# Altium schematic sheet Smartwatch_Microcontroller.SchDoc
size A4; SheetNumber: 3; SheetTotal: 4
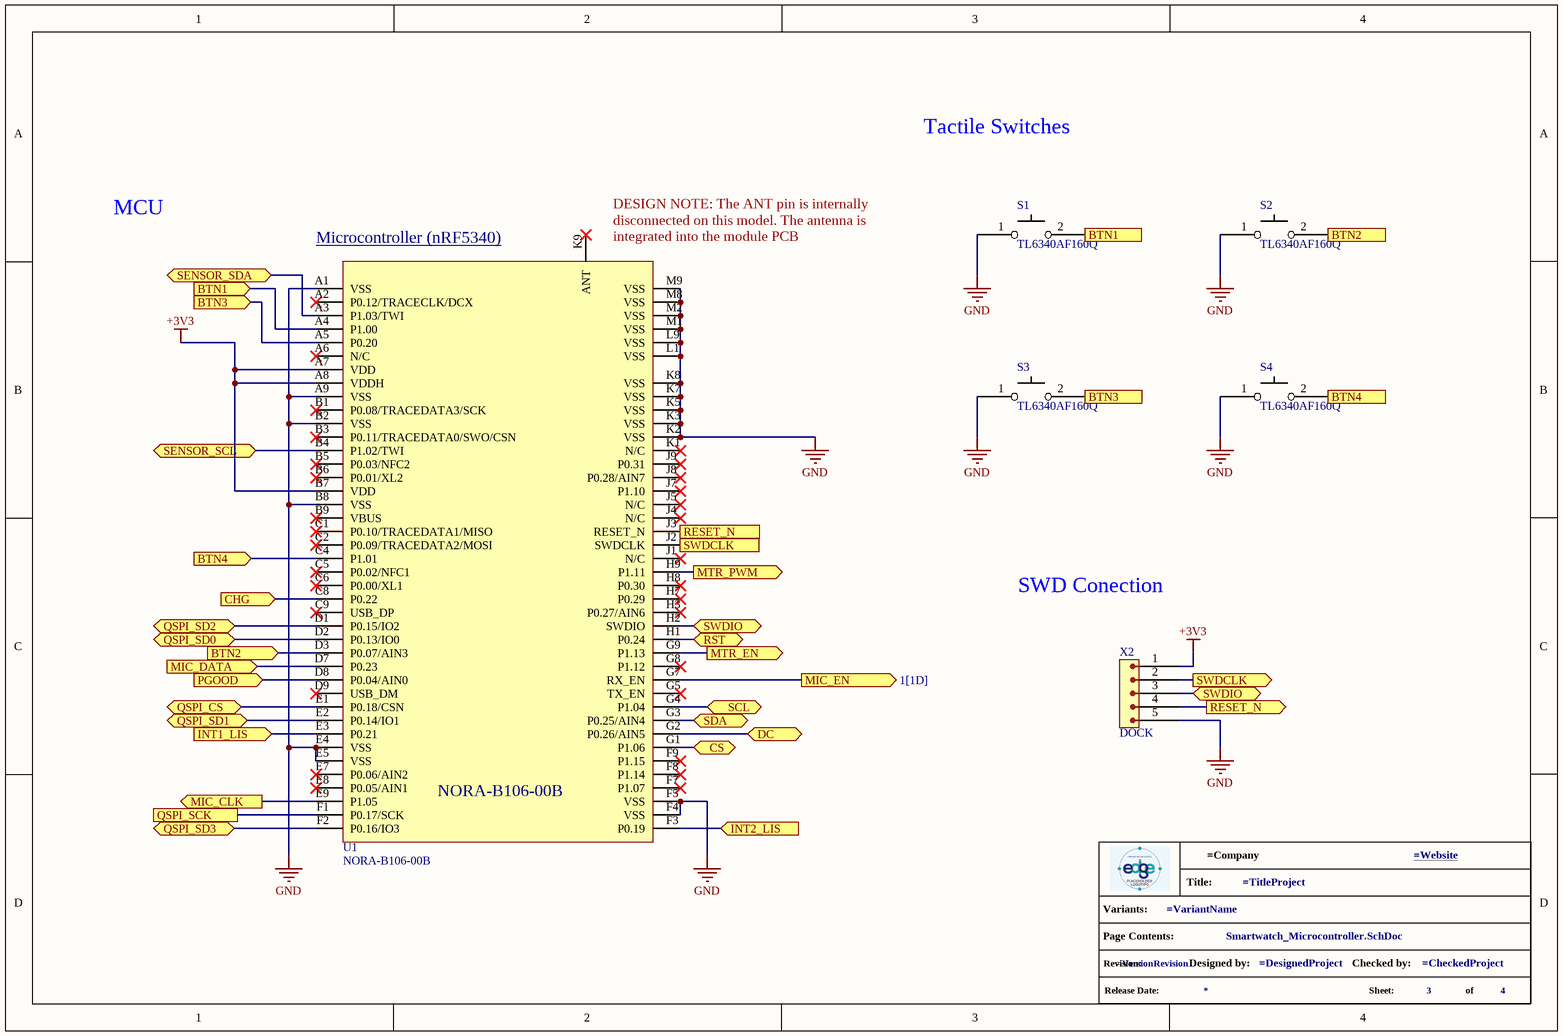
[diagram p0: Smartwatch_Microcontroller.SchDoc]

## Parts
*?  info_project  (value not drawn)  (graphical)
S1  TL6340AF160Q  [SW_TL6340AF160Q]
S2  TL6340AF160Q  [SW_TL6340AF160Q]
S3  TL6340AF160Q  [SW_TL6340AF160Q]
S4  TL6340AF160Q  [SW_TL6340AF160Q]
U1  NORA-B106-00B  [XCVR_NORA-B106-00B]
X2  DOCK  [SAMTEC_FTSH-105-XX-X-DV]

## Ports
BTN1 (in, see 3[3A]), BTN1 (out, see 3[1B]), BTN2 (in, see 3[4A]), BTN2 (out, see 3[1C]), BTN3 (in, see 3[3B]), BTN3 (out, see 3[1B]), BTN4 (in, see 3[4B]), BTN4 (out, see 3[1C]), CHG (in, see 2[4B]), CS (bidir, see 4[1B]), DC (bidir, see 4[1B]), INT1_LIS (in, see 1[2B]), INT2_LIS (in, see 1[2B]), MIC_CLK (out, see 1[1D]), MIC_DATA (in, see 1[1C]), MIC_EN (out, see 1[1D]), MTR_EN (out, see 1[1B]), MTR_PWM (out, see 1[1B]), PGOOD (in, see 2[4B]), QSPI_CS (bidir, see 1[2D]), QSPI_SCK (see 1[3D]), QSPI_SD0 (bidir, see 1[3D]), QSPI_SD1 (bidir, see 1[2D]), QSPI_SD2 (bidir, see 1[2D]), QSPI_SD3 (bidir, see 1[3D]), RESET_N (in, see 3[4C]), RESET_N (out, see 3[2C]), RST (bidir, see 4[1B]), SCL (bidir, see 4[1B]), SDA (bidir, see 4[1B]), SENSOR_SCL (bidir, see 1[2B], 1[3B], 1[4C]), SENSOR_SDA (bidir, see 1[2B], 1[3B], 1[4C]), SWDCLK (in, see 3[4C]), SWDCLK (out, see 3[2C]), SWDIO (bidir, see 3[2C]), SWDIO (bidir, see 3[4C])

## Nets
+3V3: U1.A7(VDD) U1.A8(VDDH) U1.B7(VDD) X2.1
GND: S1.1 S2.1 S3.1 S4.1 U1.A1(VSS) U1.A9(VSS) U1.B2(VSS) U1.B8(VSS) U1.E4(VSS) U1.E5(VSS) U1.F4(VSS) U1.F5(VSS) U1.K2(VSS) U1.K3(VSS) U1.K5(VSS) U1.K7(VSS) U1.K8(VSS) U1.L1(VSS) U1.L9(VSS) U1.M1(VSS) U1.M2(VSS) U1.M8(VSS) U1.M9(VSS) X2.5
BTN1: S1.2 U1.A4(P1.00) ; port BTN1
BTN2: S2.2 U1.D3(P0.07/AIN3) ; port BTN2
BTN3: S3.2 U1.A5(P0.20) ; port BTN3
BTN4: S4.2 U1.C4(P1.01) ; port BTN4
CHG: U1.C8(P0.22) ; port CHG
CS: U1.G1(P1.06) ; port CS
DC: U1.G2(P0.26/AIN5) ; port DC
INT1_LIS: U1.E3(P0.21) ; port INT1_LIS
INT2_LIS: U1.F3(P0.19) ; port INT2_LIS
MIC_CLK: U1.E9(P1.05) ; port MIC_CLK
MIC_DATA: U1.D7(P0.23) ; port MIC_DATA
MIC_EN: U1.G7(RX_EN) ; port MIC_EN
MTR_EN: U1.G9(P1.13) ; port MTR_EN
MTR_PWM: U1.H9(P1.11) ; port MTR_PWM
PGOOD: U1.D8(P0.04/AIN0) ; port PGOOD
QSPI_CS: U1.E1(P0.18/CSN) ; port QSPI_CS
QSPI_SCK: U1.F1(P0.17/SCK) ; port QSPI_SCK
QSPI_SD0: U1.D2(P0.13/IO0) ; port QSPI_SD0
QSPI_SD1: U1.E2(P0.14/IO1) ; port QSPI_SD1
QSPI_SD2: U1.D1(P0.15/IO2) ; port QSPI_SD2
QSPI_SD3: U1.F2(P0.16/IO3) ; port QSPI_SD3
RESET_N: U1.J3(RESET_N) X2.4 ; port RESET_N
RST: U1.H1(P0.24) ; port RST
SCL: U1.G4(P1.04) ; port SCL
SDA: U1.G3(P0.25/AIN4) ; port SDA
SENSOR_SCL: U1.B4(P1.02/TWI) ; port SENSOR_SCL
SENSOR_SDA: U1.A3(P1.03/TWI) ; port SENSOR_SDA
SWDCLK: U1.J2(SWDCLK) X2.2 ; port SWDCLK
SWDIO: U1.H2(SWDIO) X2.3 ; port SWDIO

Not connected (* = marked no-connect by the designer): U1 A2(P0.12/TRACECLK/DCX)* A6(N/C)* B1(P0.08/TRACEDATA3/SCK)* B3(P0.11/TRACEDATA0/SWO/CSN)* B5(P0.03/NFC2)* B6(P0.01/XL2)* B9(VBUS)* C1(P0.10/TRACEDATA1/MISO)* C2(P0.09/TRACEDATA2/MOSI)* C5(P0.02/NFC1)* C6(P0.00/XL1)* C9(USB_DP)* D9(USB_DM)* E7(P0.06/AIN2)* E8(P0.05/AIN1)* F7(P1.07)* F8(P1.14)* F9(P1.15)* G5(TX_EN)* G8(P1.12)* H3(P0.27/AIN6)* H7(P0.29)* H8(P0.30)* J1(N/C)* J4(N/C)* J5(N/C)* J7(P1.10)* J8(P0.28/AIN7)* J9(P0.31)* K1(N/C)* K9(ANT)*

## Notes on the sheet
- Tactile Switches
- MCU
- (near U1) Microcontroller (nRF5340) <https://br.mouser.com/datasheet/2/1025/NORA_B1_DataSheet_UBX_20027119-3180474.pdf>
- (near U1) DESIGN NOTE: The ANT pin is internally disconnected on this model. The antenna is integrated into the module PCB
- SWD Conection
- (in symbol info_project) Title:; Variants:; Page Contents:; Revision:; Designed by:; Checked by:; Release Date:; Sheet:; of

## Library data of the parts
S1-S4 = TL6340AF160Q: Keypad Switch, 1 Switches, SPST, Momentary-tactile, 0.02A, 12VDC, 1.57N, 2 PCB Hole Cnt, Solder Terminal, Surface Mount-right Angle; Manufacturer: E-Switch; Supplier: Mouser; Supplier Part Number: 612-TL6340AF160QG; Manufacturer Part Number: TL6340AF160Q; RoHS: Yes; Category: Tactile Switches; Stock: 2006; Pricing: 1=0,51, 10=0,478, 50=0,478, 100=0,377, 1000=0,313, 10000=0,255 (USD); ComponentLink1URL: https://datasheet.octopart.com/TL6340AF160Q-E-Switch-datasheet-155697155.pdf?src-supplier=Future+Electronics; ComponentLink1Description: https://datasheet.octopart.com/TL6340AF160Q-E-Switch-datasheet-155697155.pdf?src-supplier=Future+Electronics; ComponentLink2URL: https://datasheet.octopart.com/TL6340AF160Q-E-Switch-datasheet-165860010.pdf?src-supplier=TME; ComponentLink2Description: https://datasheet.octopart.com/TL6340AF160Q-E-Switch-datasheet-165860010.pdf?src-supplier=TME
U1 = NORA-B106-00B: Bluetooth Modules - 802.15.1 nRF5340, PCB antenna, open CPU; Manufacturer: u-blox; Supplier: Mouser; Supplier Part Number: 377-NORA-B106-00B; Manufacturer Part Number: NORA-B106-00B; RoHS: No; Category: LDO; Stock: 4440; Pricing: 1=14, 10=12,74, 50=11,72, 100=10,9, 1000=10,9, 10000=10,9 (USD); ComponentLink1URL: https://datasheet.octopart.com/NORA-B106-00B-u-blox-datasheet-166811452.pdf?src-supplier=TME; ComponentLink1Description: https://datasheet.octopart.com/NORA-B106-00B-u-blox-datasheet-166811452.pdf?src-supplier=TME
X2 = 4048: Mini SWD 0.05 Pitch Connector - 10 Pin SMT Box Header | Adafruit Industries 4048; Supplier: Mouser; Supplier Part Number: 485-4048; Manufacturer: Adafruit Industries; Manufacturer Part Number: 4048; RoHS: No; Category: Connectors; Stock: 723; Pricing: 1=1,95, 10=1,95, 50=1,95, 100=1,95, 1000=1,95, 10000=1,95 (USD); ComponentLink1URL: https://media.digikey.com/pdf/Data%20Sheets/Adafruit%20PDFs/4048_Web.pdf?src-supplier=Digikey; ComponentLink1Description: https://media.digikey.com/pdf/Data%20Sheets/Adafruit%20PDFs/4048_Web.pdf?src-supplier=Digikey